# EAGLE design SMART3RGB (EAGLE 9.6.2)
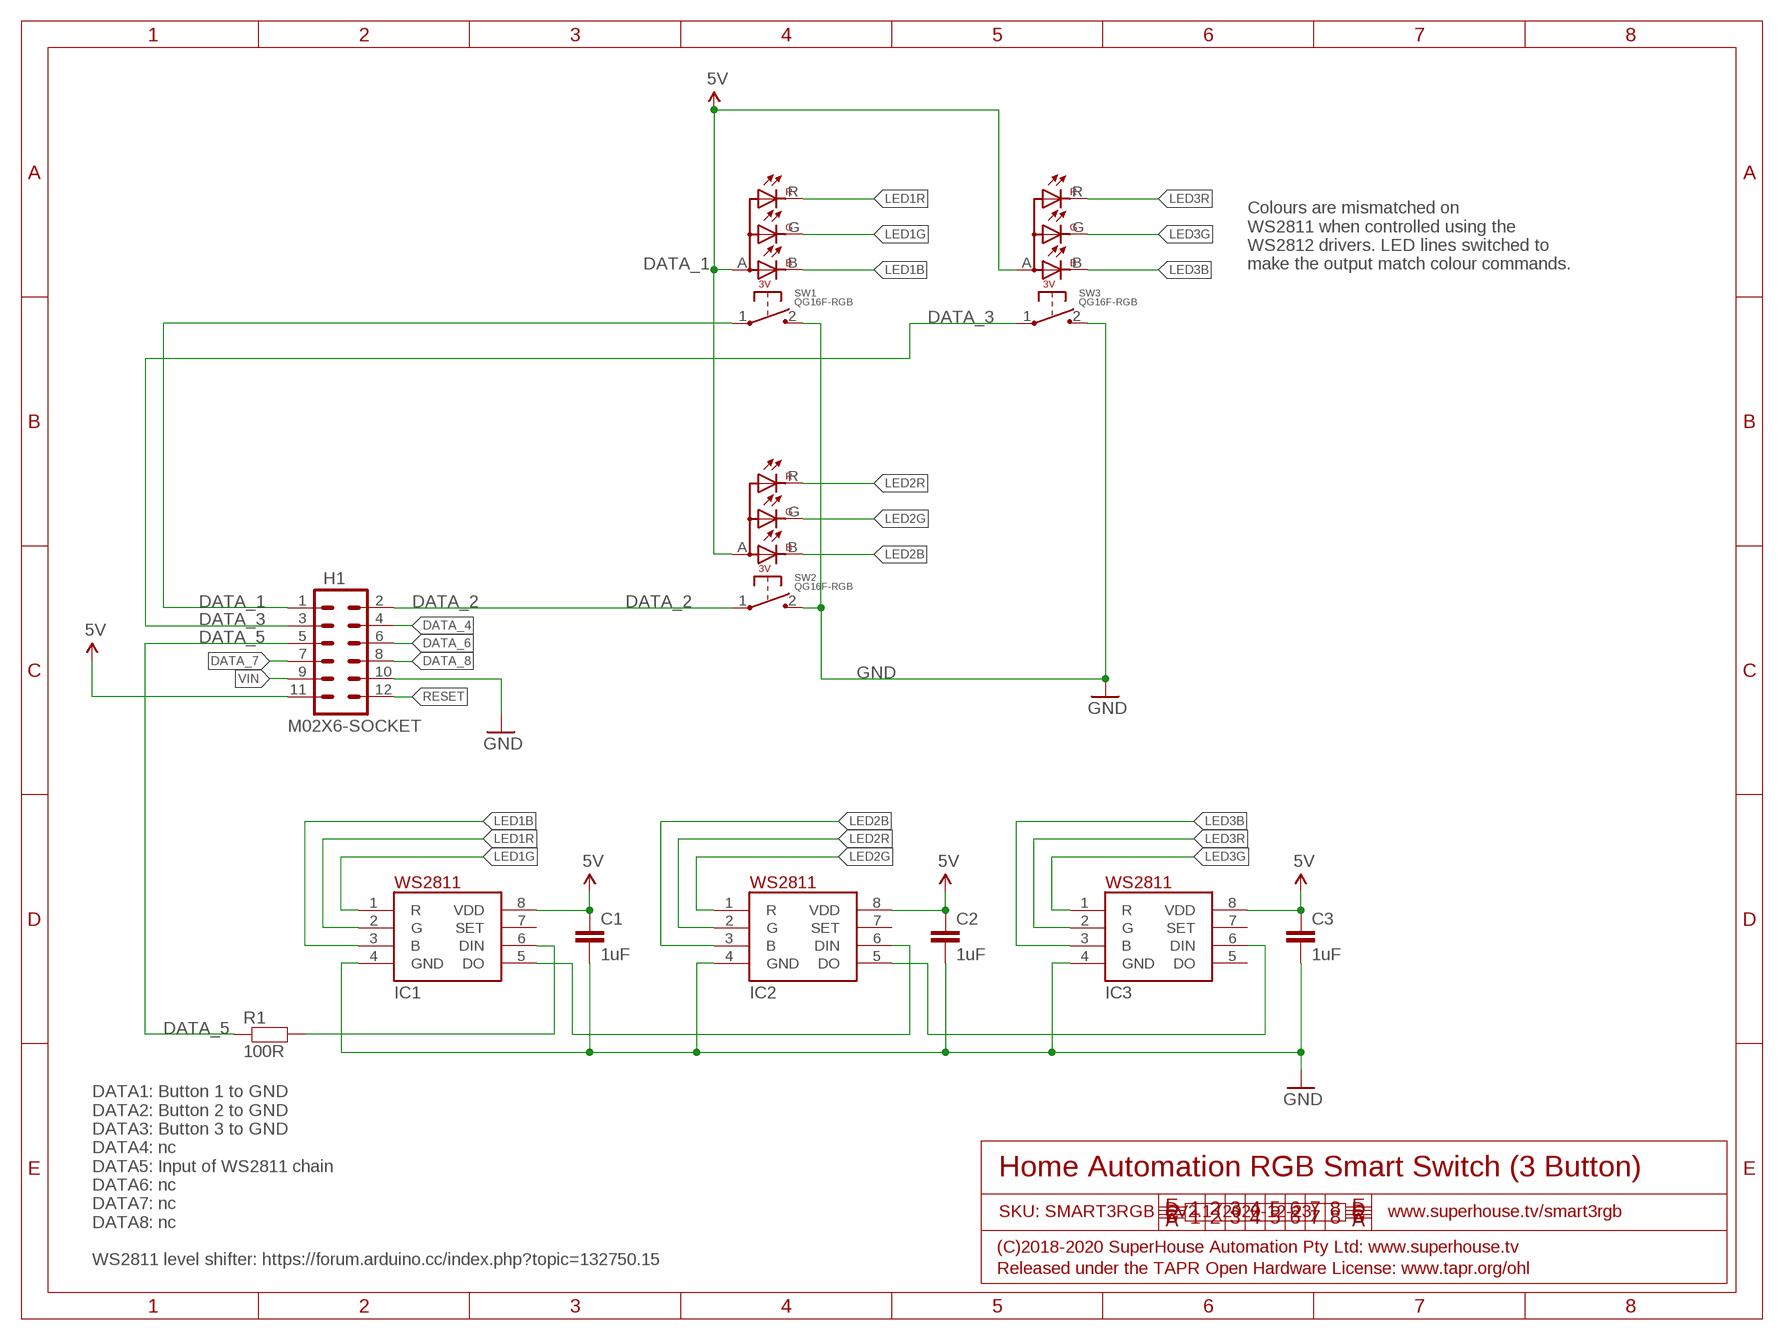
[diagram p0: schematic, sheet 1]

## Parts
C1  1uF  CAP0603  [C0603]
C2  1uF  CAP0603  [C0603]
C3  1uF  CAP0603  [C0603]
H1  M02X6-SOCKET  [2X06-S]
IC1  WS2811-SOP8  [SO08-SKINNYPADS]
IC2  WS2811-SOP8  [SO08-SKINNYPADS]
IC3  WS2811-SOP8  [SO08-SKINNYPADS]
R1  100R  RESISTOR0603  [R0603]
SW1  QG16F-RGB  [QG16F-RGB]
SW2  QG16F-RGB  [QG16F-RGB]
SW3  QG16F-RGB  [QG16F-RGB]

## Nets
5V: C1.1 C2.1 C3.1 H1.11 IC1.8(VDD) IC2.8(VDD) IC3.8(VDD) SW1.A(+) SW2.A(+) SW3.A(+)
DATA_1: H1.1 SW1.1
DATA_2: H1.2 SW2.1
DATA_3: H1.3 SW3.1
DATA_4: H1.4
DATA_5: H1.5 R1.1
DATA_6: H1.6
DATA_7: H1.7
DATA_8: H1.8
GND: C1.2 C2.2 C3.2 H1.10 IC1.4(GND) IC2.4(GND) IC3.4(GND) SW1.2 SW2.2 SW3.2
LED1B: IC1.3(B) SW1.B
LED1G: IC1.1(R) SW1.G
LED1R: IC1.2(G) SW1.R
LED2B: IC2.3(B) SW2.B
LED2G: IC2.1(R) SW2.G
LED2R: IC2.2(G) SW2.R
LED3B: IC3.3(B) SW3.B
LED3G: IC3.1(R) SW3.G
LED3R: IC3.2(G) SW3.R
N$1: IC1.6(DIN) R1.2
N$6: IC1.5(DO) IC2.6(DIN)
N$12: IC2.5(DO) IC3.6(DIN)
RESET: H1.12
VIN: H1.9
Unconnected: IC1.7(SET) IC2.7(SET) IC3.5(DO) IC3.7(SET)

## Notes on the sheet
- Colours are mismatched on
  WS2811 when controlled using the
  WS2812 drivers. LED lines switched to
  make the output match colour commands.
- Home Automation RGB Smart Switch (3 Button)
- SKU: SMART3RGB | V2.1 (2020-12-23) | www.superhouse.tv/smart3rgb
- (C)2018-2020 SuperHouse Automation Pty Ltd: www.superhouse.tv
- DATA1: Button 1 to GND
  DATA2: Button 2 to GND
  DATA3: Button 3 to GND
  DATA4: nc
  DATA5: Input of WS2811 chain
  DATA6: nc
  DATA7: nc
  DATA8: nc
  
  WS2811 level shifter: https://forum.arduino.cc/index.php?topic=132750.15
- Released under the TAPR Open Hardware License: www.tapr.org/ohl

## Library data of the parts
C1-C3 = SuperHouse-DiscreteSemi:CAP: Capacitor Standard ceramic capacitor
H1 = SuperHouse-Connectors:M02X6: M12 header in 2x6 format
IC1-IC3 = SuperHouse-ICs:WS2811: WS2811 LED driver
R1 = SuperHouse-DiscreteSemi:RESISTOR: Resistors in both surface-mount and through-hole versions.
SW1-SW3 = SuperHouse-Switches:QG16F-RGB: RGB illuminated chrome bezel button

## Net classes
0 Default: width 0.203 mm
1 VCC: width 0.305 mm

## Board
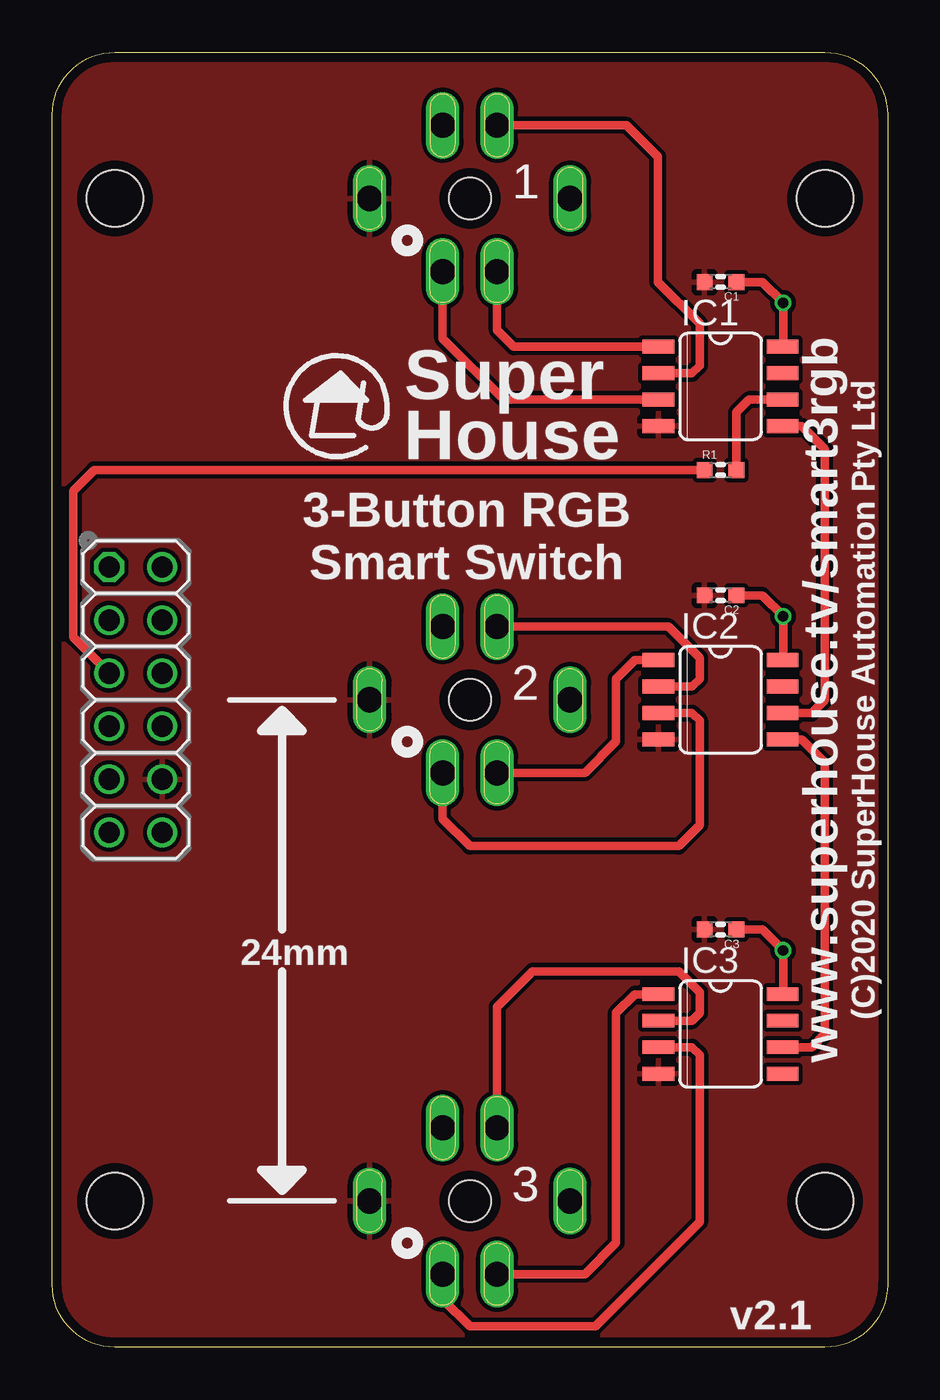
[diagram p1: board, top side]
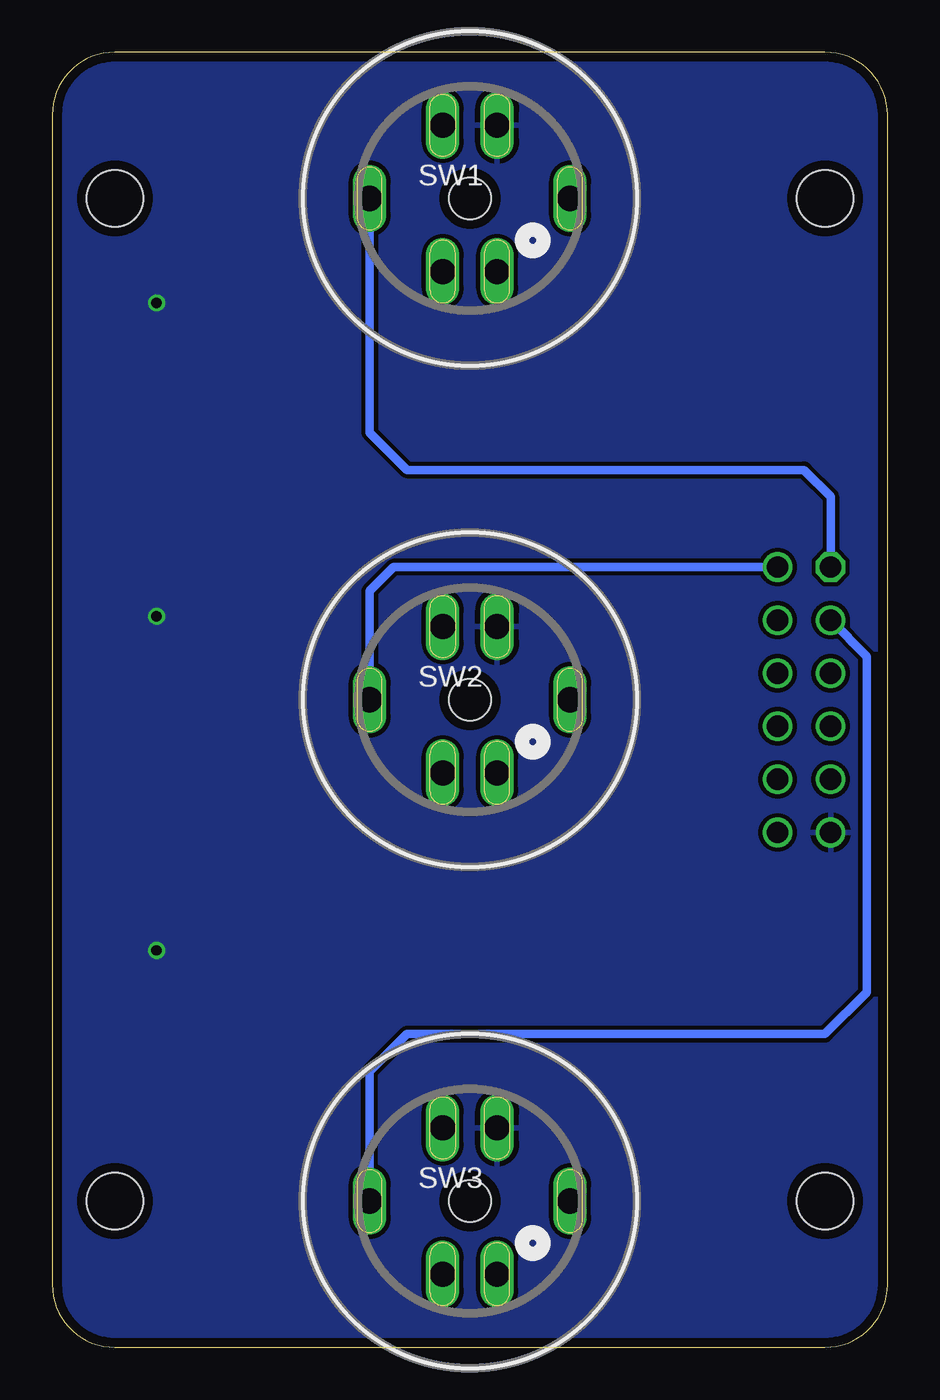
[diagram p2: board, bottom side, seen from below]

Size 40 x 62 mm. Coordinates in mm from the lower left corner, seen from the top.
Outline: 37,0 3,0 arc-90 0,3 0,59 arc-90 3,62 37,62 arc-90 40,59 40,3 arc-90 37,0
Copper layers (1*16): Top 0.035mm / dielectric 1.5mm / Bottom 0.035mm
Design rules "default *": minimum track width 8mil, minimum drill 15mil, track to track 8mil, track to pad 8mil, pad to pad 8mil, via to via 8mil, smd to smd 8mil, copper to edge 18mil, drill to drill 8mil, minimum pad ring 8mil, minimum via ring 6mil, stop-mask expansion 4mil, vias tented up to drill 25mil, thermal gap 10mil
Holes 2 mm at 20,31 20,55 20,7
Holes 2.7 mm at 3,7 3,55 37,55 37,7

### Footprints (pad centres in the part's own frame; a part is rotated, then mirrored left to right if it is on the bottom)
C0603 = smd 0.762 x 0.762: 1 -0.762,0; 2 0.762,0
2X06-S = drill 1.016 octagon: 1 -6.35,-1.27 | drill 1.016: 2 -6.35,1.27; 3 -3.81,-1.27; 4 -3.81,1.27; 5 -1.27,-1.27; 6 -1.27,1.27; 7 1.27,-1.27; 8 1.27,1.27; 9 3.81,-1.27; 10 3.81,1.27; 11 6.35,-1.27; 12 6.35,1.27
SO08-SKINNYPADS = smd 0.66 x 1.524: 1 -1.905,-2.973; 2 -0.635,-2.973; 3 0.635,-2.973; 4 1.905,-2.973; 5 1.905,2.973; 6 0.635,2.973; 7 -0.635,2.973; 8 -1.905,2.973
R0603 = smd 0.762 x 0.762: 1 -0.762,0; 2 0.762,0
QG16F-RGB = drill 1.2 long: 1 -4.8,0; 2 4.8,0; A 1.3,3.5; B 1.3,-3.5; G -1.3,-3.5; R -1.3,3.5

### Placement (x,y rotation side)
C1  32,51 180 top
C2  32,36 180 top
C3  32,20 180 top
H1  4,31 270 top
IC1  32,46 270 top
IC2  32,31 270 top
IC3  32,15 270 top
R1  32,42 0 top
SW1  20,55 0 bottom
SW2  20,31 0 bottom
SW3  20,7 0 bottom

### Tracks (layer width: path | path; a pad name or v marks a point on that pad's centre or on a via)
5V  (via drill 0.5)
  Top 0.406: C3.1 34,20 v35,19 35,16.93 IC3.8 | C1.1 34,51 v35,50 35,47.93 IC1.8 | C2.1 34,36 v35,35 35,32.93 IC2.8
  pour Bottom: 37,62 3,62 arc90 0,59 0,3 arc90 3,0 37,0 arc90 40,3 40,59 arc90
DATA_1
  Bottom 0.406: SW1.1 24.8,43.8 23,42 4,42 2.73,40.73 H1.1
DATA_2
  Bottom 0.406: H1.2 23.65,37.35 24.8,36.2 SW2.1
DATA_3
  Bottom 0.406: SW3.1 24.8,13.2 23,15 3,15 1,17 1,33.08 H1.3
DATA_5
  Top 0.406: R1.1 2,42 1,41 1,34 H1.5
GND
  pour Top: 37,62 3,62 arc90 0,59 0,3 arc90 3,0 37,0 arc90 40,3 40,59 arc90
LED1B
  Top 0.406: SW1.B 18.7,48.3 21.64,45.37 IC1.3
LED1G
  Top 0.406: IC1.1 22.09,47.91 21.3,48.7 SW1.G
LED1R
  Top 0.406: SW1.R 27.5,58.5 29,57 29,51 31,49 31,47 30.64,46.63 IC1.2
LED2B
  Top 0.406: IC2.3 30.64,30.36 31,30 31,25 30,24 20,24 18.7,25.3 SW2.B
LED2G
  Top 0.406: IC2.1 27.91,32.91 27,32 27,29 25.5,27.5 SW2.G
LED2R
  Top 0.406: IC2.2 30.64,31.64 31,32 31,33 29.5,34.5 SW2.R
LED3B
  Top 0.406: IC3.3 30.64,14.37 31,14 31,6 26,1 20,1 18.7,2.3 SW3.B
LED3G
  Top 0.406: IC3.1 27.91,16.91 27,16 27,5 25.5,3.5 SW3.G
LED3R
  Top 0.406: IC3.2 30.64,15.63 31,16 31,17 30,18 23,18 21.3,16.3 SW3.R
N$1
  Top 0.406: IC1.6 33.37,45.37 32.76,44.76 R1.2
N$6
  Top 0.406: IC2.6 36.37,30.36 37,31 37,43 35.91,44.09 IC1.5
N$12
  Top 0.406: IC3.6 36.37,14.37 37,15 37,28 35.91,29.09 IC2.5

### Text on the board
tPlace: 1 | Super / House | 3-Button RGB / Smart Switch | 2 | www.superhouse.tv/smart3rgb | (C)2020 SuperHouse Automation Pty Ltd | 24mm | 3 | v2.1